# EAGLE design daisy_mp3 (EAGLE 4.16)
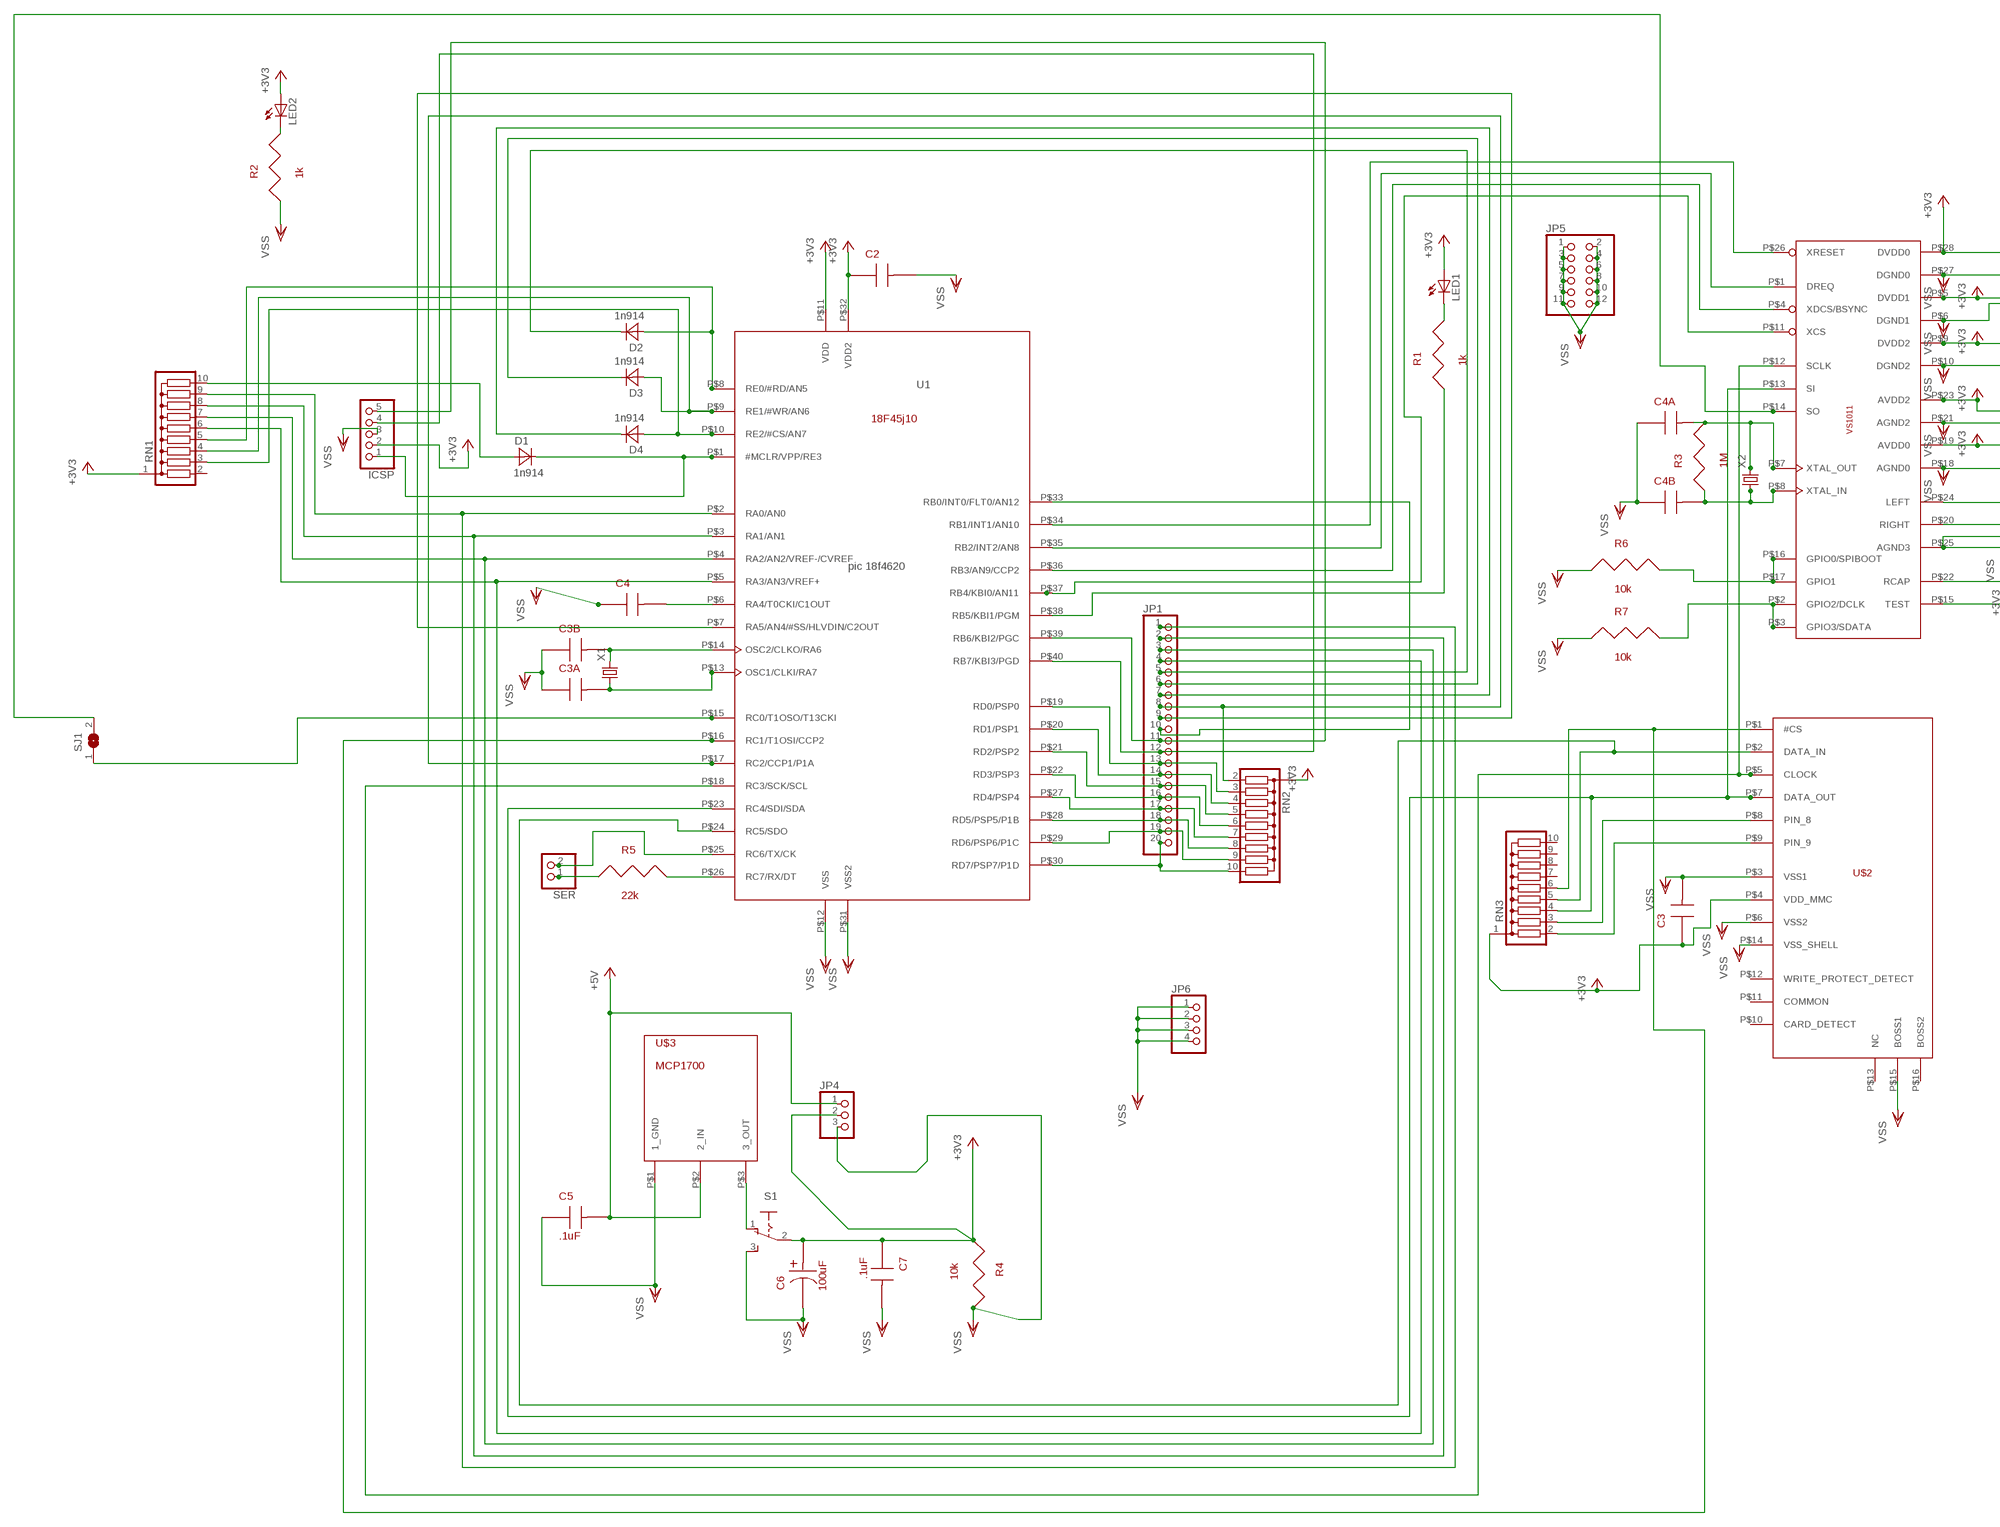
[diagram p0: schematic, sheet 1, part 1 of 2]
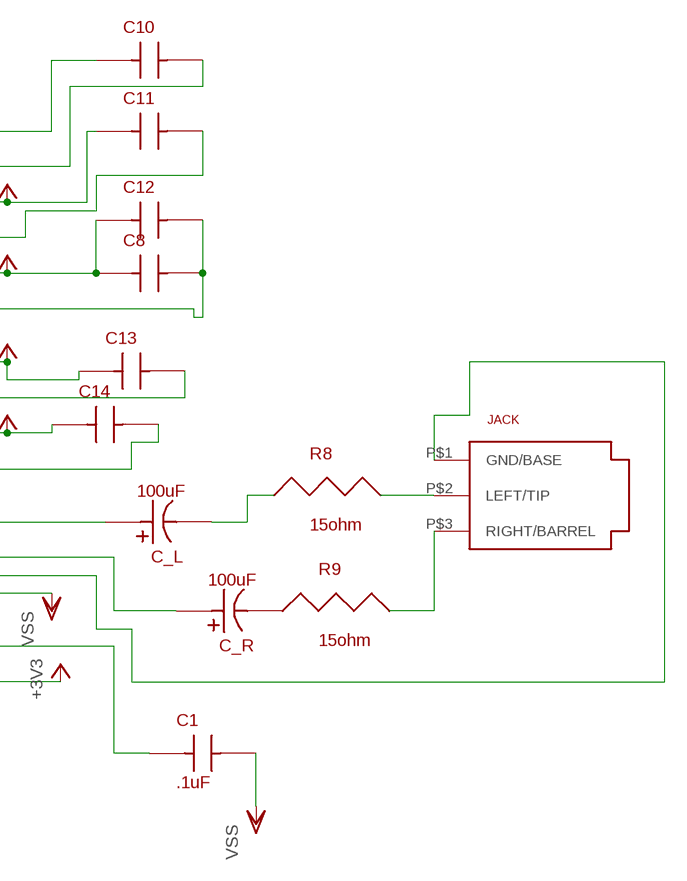
[diagram p1: schematic, sheet 1, part 2 of 2]

## Parts
C1  .1uF  CAPACITOR  [.1"_SPACE]
C2  CAPACITOR  [.1"_SPACE]
C3  CAPACITOR  [.1"_SPACE]
C3A  CAPACITOR  [.1"_SPACE]
C3B  CAPACITOR  [.1"_SPACE]
C4  CAPACITOR  [.1"_SPACE]
C4A  CAPACITOR  [.1"_SPACE]
C4B  CAPACITOR  [.1"_SPACE]
C5  .1uF  CAPACITOR  [.1"_SPACE]
C6  100uF  CAPACITOR_POLARIZED.2"  [.2"]
C7  .1uF  CAPACITOR  [.1"_SPACE]
C8  CAPACITOR  [.1"_SPACE]
C10  CAPACITOR  [.1"_SPACE]
C11  CAPACITOR  [.1"_SPACE]
C12  CAPACITOR  [.1"_SPACE]
C13  CAPACITOR  [.1"_SPACE]
C14  CAPACITOR  [.1"_SPACE]
C_L  100uF  CAPACITOR_POLARIZED.1"  [.1"]
C_R  100uF  CAPACITOR_POLARIZED.1"  [.1"]
D1  1n914  A_SIMPLE_DIODE  [.1"]
D2  1n914  A_SIMPLE_DIODE  [.1"]
D3  1n914  A_SIMPLE_DIODE  [.1"]
D4  1n914  A_SIMPLE_DIODE  [.1"]
ICSP  PINHD-1X5  [1X05]
JACK  STEREO_JACK  [STEREO_JACK]
JP1  PINHD-1X20  [1X20]
JP4  PINHD-1X3  [1X03]
JP5  PINHD-2X6  [2X06]
JP6  PINHD-1X4  [1X04]
LED1  LED5MM  [LED5MM]
LED2  LED5MM  [LED5MM]
R1  1k  RESISTOR.1  [.1"]
R2  1k  RESISTOR.1  [.1"]
R3  1M  RESISTOR.1  [.1"]
R4  10k  RESISTOR.1  [.1"]
R5  22k  RESISTOR.1  [.1"]
R6  10k  RESISTOR.1  [.1"]
R7  10k  RESISTOR.1  [.1"]
R8  15ohm  RESISTOR.1  [.1"]
R9  15ohm  RESISTOR.1  [.1"]
RN1  G09R  [SIL10]
RN2  G09R  [SIL10]
RN3  G09R  [SIL10]
S1  M251RAFFENBERG  [M251]
SER  PINHD-1X2  [1X02]
SJ1  SJ  [SJ]
U1  18F45j10  18F4620  [DIP40]
U$2  MMC_SOCKET_ALPS  [MMC_SD_0MM_STANDOFF_ALPS]
U$3  MCP1700  [TO92]
VS1011  VS1011  [SOIC28]
X1  CRYTALHC49U70  [HC49U70]
X2  CRYTALHC49U70  [HC49U70]

## Nets
+3V3: C2.P$1 C3.P$1 C6.P$2 C7.P$1 C8.P$1 C10.P$1 C11.P$1 C12.P$1 C13.P$1 C14.P$1 ICSP.2 JP4.2 LED1.A LED2.A R4.P$1 RN1.1 RN2.1 RN3.1 S1.2(P) U1.P$11(VDD) U1.P$32(VDD2) U$2.P$4(VDD_MMC) VS1011.P$5(DVDD1) VS1011.P$9(DVDD2) VS1011.P$15(TEST) VS1011.P$19(AVDD0) VS1011.P$23(AVDD2) VS1011.P$28(DVDD0)
+5V: C5.P$2 JP4.1 U$3.P$2(2_IN)
N$1: C_R.P$2 VS1011.P$20(RIGHT)
N$2: JP1.20 RN2.10 U1.P$30(RD7/PSP7/P1D)
N$3: C1.P$1 VS1011.P$22(RCAP)
N$4: R5.P$2 U1.P$26(RC7/RX/DT)
N$5: R6.P$2 VS1011.P$16(GPIO0/SPIBOOT) VS1011.P$17(GPIO1)
N$6: R7.P$2 VS1011.P$2(GPIO2/DCLK) VS1011.P$3(GPIO3/SDATA)
N$7: C4A.P$2 R3.P$2 VS1011.P$7(XTAL_OUT) X2.2
N$8: C4B.P$2 R3.P$1 VS1011.P$8(XTAL_IN) X2.1
N$9: JP1.19 RN2.9 U1.P$29(RD6/PSP6/P1C)
N$10: JP1.18 RN2.8 U1.P$28(RD5/PSP5/P1B)
N$11: JP1.17 RN2.7 U1.P$27(RD4/PSP4)
N$12: JP1.16 RN2.6 U1.P$22(RD3/PSP3)
N$13: JP1.15 RN2.5 U1.P$21(RD2/PSP2)
N$14: JP1.14 RN2.4 U1.P$20(RD1/PSP1)
N$15: JP1.13 RN2.3 U1.P$19(RD0/PSP0)
N$16: JP1.1 RN1.9 U1.P$2(RA0/AN0)
N$17: JP1.2 RN1.8 U1.P$3(RA1/AN1)
N$18: JP1.3 RN1.7 U1.P$4(RA2/AN2/VREF-/CVREF)
N$19: JP1.4 RN1.6 U1.P$5(RA3/AN3/VREF+)
N$20: D2.P$1(A) RN1.5 U1.P$8(RE0/#RD/AN5)
N$21: D3.P$1(A) RN1.4 U1.P$9(RE1/#WR/AN6)
N$22: D4.P$1(A) RN1.3 U1.P$10(RE2/#CS/AN7)
N$23: D2.P$2(C) JP1.5
N$24: D3.P$2(C) JP1.6
N$25: D4.P$2(C) JP1.7
N$26: JP1.8 RN2.2 U1.P$17(RC2/CCP1/P1A)
N$27: S1.1(O) U$3.P$3(3_OUT)
N$28: RN3.2 U$2.P$9(PIN_9)
N$29: C3B.P$2 U1.P$14(OSC2/CLKO/RA6) X1.2
N$30: C3A.P$2 U1.P$13(OSC1/CLKI/RA7) X1.1
N$31: R5.P$1 SER.1
N$32: SER.2 U1.P$25(RC6/TX/CK)
N$33: JP1.9 U1.P$7(RA5/AN4/#SS/HLVDIN/C2OUT)
N$34: JP1.10 U1.P$33(RB0/INT0/FLT0/AN12)
N$35: ICSP.5 JP1.11 U1.P$39(RB6/KBI2/PGC)
N$36: C4.P$2 U1.P$6(RA4/T0CKI/C1OUT)
N$37: SJ1.1 U1.P$15(RC0/T1OSO/T13CKI)
N$38: RN3.3 U$2.P$8(PIN_8)
N$39: RN3.4 U1.P$23(RC4/SDI/SDA) U$2.P$7(DATA_OUT) VS1011.P$13(SI)
N$40: SJ1.2 VS1011.P$14(SO)
N$41: RN3.5 U1.P$24(RC5/SDO) U$2.P$2(DATA_IN)
N$42: RN3.6 U1.P$16(RC1/T1OSI/CCP2) U$2.P$1(#CS)
N$43: U1.P$18(RC3/SCK/SCL) U$2.P$5(CLOCK) VS1011.P$12(SCLK)
N$44: C_L.P$1 R8.P$1
N$45: C_L.P$2 VS1011.P$24(LEFT)
N$46: JACK.P$2(LEFT/TIP) R8.P$2
N$47: JACK.P$3(RIGHT/BARREL) R9.P$2
N$48: LED1.K(C) R1.P$2
N$49: LED2.K(C) R2.P$2
N$50: R1.P$1 U1.P$38(RB5/KBI1/PGM)
N$51: U1.P$34(RB1/INT1/AN10) VS1011.P$26(XRESET)
N$52: U1.P$35(RB2/INT2/AN8) VS1011.P$1(DREQ)
N$53: U1.P$36(RB3/AN9/CCP2) VS1011.P$4(XDCS/BSYNC)
N$54: U1.P$37(RB4/KBI0/AN11) VS1011.P$11(XCS)
N$55: D1.P$2(C) ICSP.1 U1.P$1(#MCLR/VPP/RE3)
N$56: D1.P$1(A) RN1.10
N$57: ICSP.4 JP1.12 U1.P$40(RB7/KBI3/PGD)
N$59: C_R.P$1 R9.P$1
VSS: C1.P$2 C2.P$2 C3.P$2 C3A.P$1 C3B.P$1 C4.P$1 C4A.P$1 C4B.P$1 C5.P$1 C6.P$1 C7.P$2 C8.P$2 C10.P$2 C11.P$2 C12.P$2 C13.P$2 C14.P$2 ICSP.3 JACK.P$1(GND/BASE) JP4.3 JP5.1 JP5.2 JP5.3 JP5.4 JP5.5 JP5.6 JP5.7 JP5.8 JP5.9 JP5.10 JP5.11 JP5.12 JP6.1 JP6.2 JP6.3 JP6.4 R2.P$1 R4.P$2 R6.P$1 R7.P$1 S1.3(S) U1.P$12(VSS) U1.P$31(VSS2) U$2.P$3(VSS1) U$2.P$6(VSS2) U$2.P$14(VSS_SHELL) U$2.P$15(BOSS1) U$3.P$1(1_GND) VS1011.P$6(DGND1) VS1011.P$10(DGND2) VS1011.P$18(AGND0) VS1011.P$21(AGND2) VS1011.P$25(AGND3) VS1011.P$27(DGND0)
Unconnected: RN1.2 RN3.7 RN3.8 RN3.9 RN3.10 U$2.P$10(CARD_DETECT) U$2.P$11(COMMON) U$2.P$12(WRITE_PROTECT_DETECT) U$2.P$13(NC)

## Power pins joined to a net without a drawn wire
BOSS2: U$2.P$16(BOSS2)

## Library data of the parts
C1-C3 C3A C3B C4 C4A C4B C5 C7 C8 C10-C14 = capacitors:CAPACITOR
C6 C_L C_R = capacitors_polarized:CAPACITOR_POLARIZED
D1-D4 = diode:A_SIMPLE_DIODE
ICSP = pinhead:PINHD-1X5: PIN HEADER
JACK = stereo_jack_cuistack__sj3523sm:STEREO_JACK
JP1 = pinhead:PINHD-1X20: PIN HEADER
JP4 = pinhead:PINHD-1X3: PIN HEADER
JP5 = pinhead:PINHD-2X6: PIN HEADER
JP6 = pinhead:PINHD-1X4: PIN HEADER
LED1 LED2 = led:LED: LED OSRAM: - CHIPLED LG R971, LG N971, LY N971, LG Q971, LY Q971, LO R971, LY R971 LH N974, LH R974 LS Q976, LO Q976, LY Q976 LO Q996 - Hyper CHIPLED LW Q18S LB Q993, LB Q99A, LB R99A - SideLED LS A670, LO A670, LY A670, LG A670, LP A670 LB A673, LV A673, LT A673, LW A673 LH A674 LY A675 LS A676, LA A676, LO A676, LY A676, LW A676 LS A679, LY A679, LG A679 - Hyper Micro SIDELED® LS Y876, LA Y876, LO Y876, LY Y876 LT Y87S - SmartLED LW L88C, LW L88S LB L89C, LB L89S, LG L890 LS L89K, LO L89K, LY L89K LS L896, LA L896, LO L896, LY L896 - TOPLED LS T670, LO T670, LY T670, LG T670, LP T670 LSG T670, LSP T670, LSY T670, LOP T670, LYG T670 LG T671, LOG T671, LSG T671 LB T673, LV T673, LT T673, LW T673 LH T674 LS T676, LA T676, LO T676, LY T676, LB T676, LH T676, LSB T676, LW T676 LB T67C, LV T67C, LT T67C, LS T67K, LO T67K, LY T67K, LW E67C LS E67B, LA E67B, LO E67B, LY E67B, LB E67C, LV E67C, LT E67C LW T67C LS T679, LY T679, LG T679 LS T770, LO T770, LY T770, LG T770, LP T770 LB T773, LV T773, LT T773, LW T773 LH T774 LS E675, LA E675, LY E675, LS T675 LS T776, LA T776, LO T776, LY T776, LB T776 LHGB T686 LT T68C, LB T68C - Hyper Mini TOPLED® LB M676 - Mini TOPLED Santana® LG M470 LS M47K, LO M47K, LY M47K Source: http://www.osram.convergy.de/
R1-R9 = resistor:RESISTOR
RN1-RN3 = resistor-sil:G09R: SIL RESISTOR
S1 = switchRaff:M251: SLIDING SWITCH Mors, distributor Buerklin, 11G702
SER = pinhead:PINHD-1X2: PIN HEADER
SJ1 = jumper:SJ: SMD solder JUMPER
U1 = 18F4620:18F4620
U$2 = MMC_SD_alps_socket:MMC_SOCKET_ALPS
U$3 = mcp1700_vregulator:MCP1700
VS1011 = vs1011:VS1011
X1 X2 = crystal:CRYTAL: CRYSTAL

## Board
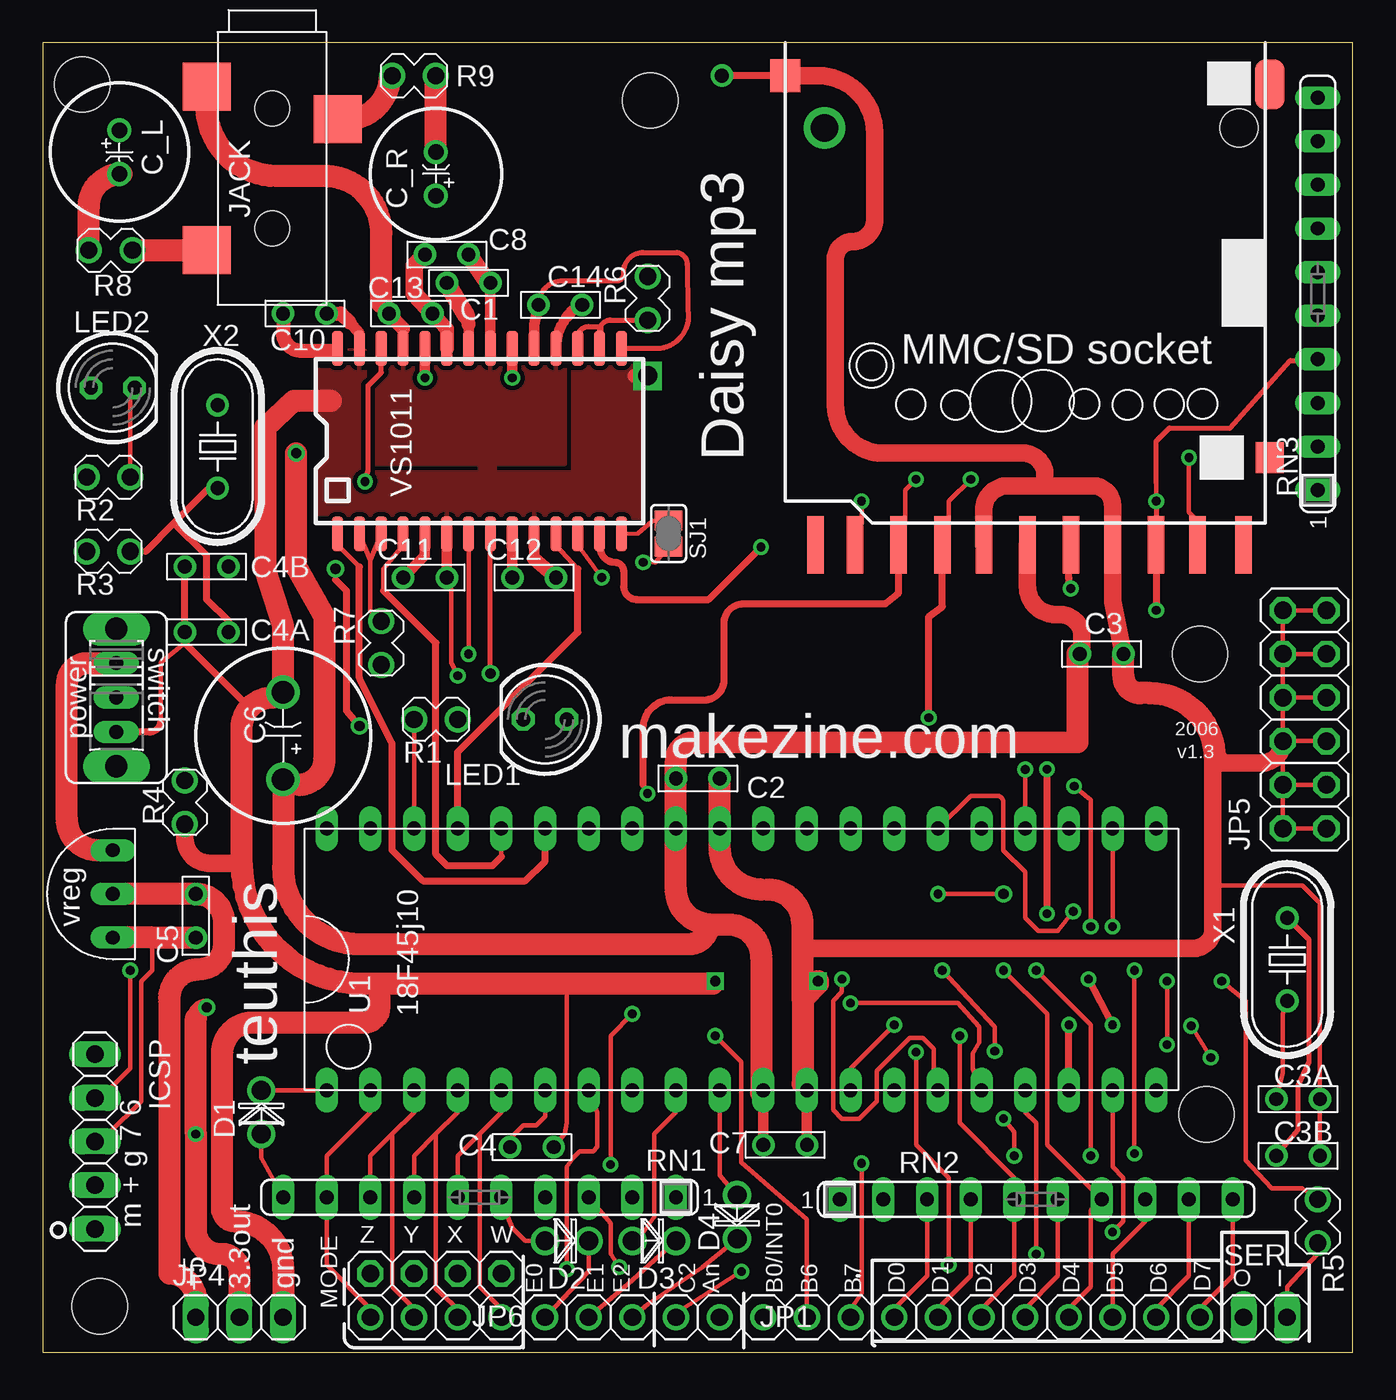
[diagram p2: board, top side]
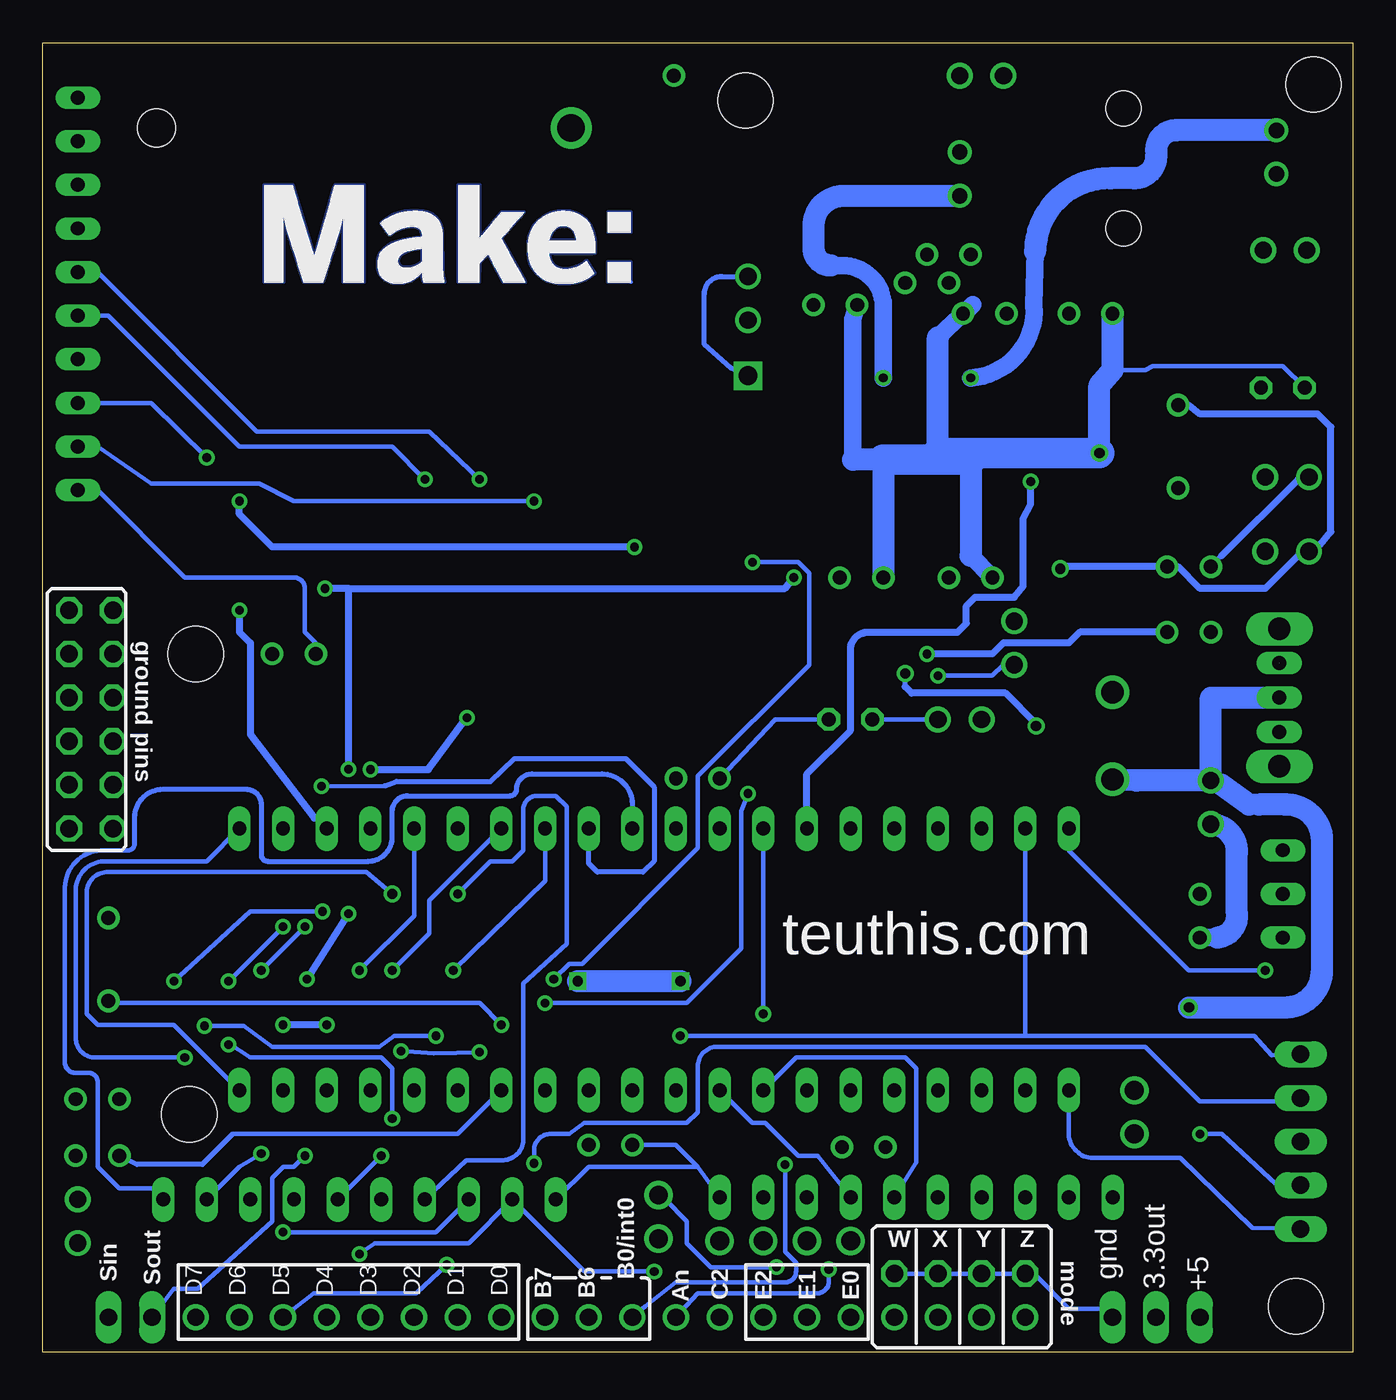
[diagram p3: board, bottom side, seen from below]

Size 76.2 x 76.2 mm. Coordinates in mm from the lower left corner, seen from the top.
Outline: 0,0 76.2,0 76.2,76.2 0,76.2 0,0
Copper layers (1*16): Top 0.035mm / dielectric 1.5mm / Bottom 0.035mm
Design rules "default": minimum track width 10mil, minimum drill 20mil, track to track 8mil, track to pad 8mil, pad to pad 8mil, via to via 8mil, smd to smd 8mil, copper to edge 20mil, drill to drill 8mil, minimum pad ring 10mil, minimum via ring 8mil, stop-mask expansion 4mil, vias tented up to drill 0mil, thermal gap 10mil
Holes 3.2 mm at 35.33,72.85 2.29,73.79 3.3,2.67 67.31,40.64 67.69,13.84
tRestrict: area 67.3,50.8 to 69.8,53.3; area 68.6,59.7 to 71.1,64.8; area 47,55.9 to 49.5,59.1; area 49.5,54 to 51.4,55.9; area 52.1,54 to 54,55.9; area 54.6,53.3 to 59.7,57.8; area 53.3,54 to 55.9,56.5; area 59.7,54 to 61.6,55.9; area 62.2,54 to 64.1,55.9; area 64.8,54 to 68.6,55.9

### Footprints (pad centres in the part's own frame; a part is rotated, then mirrored left to right if it is on the bottom)
.1"_SPACE = drill 0.8 round: P$1 -1.27,0; P$2 1.27,0
.2" = drill 1.3 round: P$1 -2.54,0; P$2 2.54,0
.1" = drill 0.9 round: P$1 -1.27,0; P$2 1.27,0
.1"' = drill 1.1 round: P$1 -1.27,0; P$2 1.27,0
1X05 = drill 1.016 long: 1 -5.08,0; 2 -2.54,0; 3 0,0; 4 2.54,0; 5 5.08,0
STEREO_JACK = smd 2.794 x 2.794: P$1 0,0; P$2 0,-9.525; P$3 7.62,-1.905 | hole 2: 3.81,-1.27; 3.81,-8.255
1X20 = drill 1.016 round: 1 -24.13,0; 2 -21.59,0; 3 -19.05,0; 4 -16.51,0; 5 -13.97,0; 6 -11.43,0; 7 -8.89,0; 8 -6.35,0; 9 -3.81,0; 10 -1.27,0; 11 1.27,0; 12 3.81,0; 13 6.35,0; 14 8.89,0; 15 11.43,0; 16 13.97,0; 17 16.51,0; 18 19.05,0; 19 21.59,0; 20 24.13,0
1X03 = drill 1.016 long: 1 -2.54,0; 2 0,0; 3 2.54,0
2X06 = drill 1.016 octagon: 1 -6.35,-1.27; 2 -6.35,1.27; 3 -3.81,-1.27; 4 -3.81,1.27; 5 -1.27,-1.27; 6 -1.27,1.27; 7 1.27,-1.27; 8 1.27,1.27; 9 3.81,-1.27; 10 3.81,1.27; 11 6.35,-1.27; 12 6.35,1.27
1X04 = drill 1.016 octagon: 1 -3.81,0; 2 -1.27,0; 3 1.27,0; 4 3.81,0
LED5MM = drill 0.813 octagon: A -1.27,0; K 1.27,0
.1"'' = drill 1 round: P$1 -1.27,0; P$2 1.27,0
SIL10 = drill 0.813 long: 1 -11.43,0; 2 -8.89,0; 3 -6.35,0; 4 -3.81,0; 5 -1.27,0; 6 1.27,0; 7 3.81,0; 8 6.35,0; 9 8.89,0; 10 11.43,0
M251 = drill 0.813 long: 1 -2,0; 2 0,0; 3 2,0 | drill 1.3 pad 1.676 long: P$1 -4,0; P$2 4,0
1X02 = drill 1.016 long: 1 -1.27,0; 2 1.27,0
SJ = smd 1.168 x 1.6: 1 -0.762,0; 2 0.762,0
DIP40 = drill 0.8 pad 1.27 long: P$1 -7.62,24.13; P$2 -7.62,21.59; P$3 -7.62,19.05; P$4 -7.62,16.51; P$5 -7.62,13.97; P$6 -7.62,11.43; P$7 -7.62,8.89; P$8 -7.62,6.35; P$9 -7.62,3.81; P$10 -7.62,1.27; P$11 -7.62,-1.27; P$12 -7.62,-3.81; P$13 -7.62,-6.35; P$14 -7.62,-8.89; P$15 -7.62,-11.43; P$16 -7.62,-13.97; P$17 -7.62,-16.51; P$18 -7.62,-19.05; P$19 -7.62,-21.59; P$20 -7.62,-24.13; P$21 7.62,-24.13; P$22 7.62,-21.59; P$23 7.62,-19.05; P$24 7.62,-16.51; P$25 7.62,-13.97; P$26 7.62,-11.43; P$27 7.62,-8.89; P$28 7.62,-6.35; P$29 7.62,-3.81; P$30 7.62,-1.27; P$31 7.62,1.27; P$32 7.62,3.81; P$33 7.62,6.35; P$34 7.62,8.89; P$35 7.62,11.43; P$36 7.62,13.97; P$37 7.62,16.51; P$38 7.62,19.05; P$39 7.62,21.59; P$40 7.62,24.13
MMC_SD_0MM_STANDOFF_ALPS = smd 0.991 x 3.302: P$1 20.066,0; P$2 17.526,0; P$3 15.113,0; P$4 12.573,0; P$5 10.033,0; P$6 7.62,0; P$7 5.08,0; P$8 2.667,0; P$9 22.606,0; P$10 0,0; P$13 24.892,0 | smd 1.702 x 1.803: P$11 -1.524,-5.08 | smd 1.702 x 2.896: P$12 -1.524,-26.797 | smd 1.803 x 1.905: P$14 26.67,-27.305 | drill 0.8 round: P$15 30.353,-27.305 | drill 1.6 pad 1.676 round: P$16 24.384,-24.257 | hole 2.2: 0.254,-24.257
TO92 = drill 0.8 long: P$1 0,0; P$2 2.54,0; P$3 5.08,0
SOIC28 = smd 2.032 x 0.66: P$1 -5.715,8.255; P$2 -5.715,6.985; P$3 -5.715,5.715; P$4 -5.715,4.445; P$5 -5.715,3.175; P$6 -5.715,1.905; P$7 -5.715,0.635; P$8 -5.715,-0.635; P$9 -5.715,-1.905; P$10 -5.715,-3.175; P$11 -5.715,-4.445; P$12 -5.715,-5.715; P$13 -5.715,-6.985; P$14 -5.715,-8.255; P$15 5.08,-8.255; P$16 5.08,-6.985; P$17 5.08,-5.715; P$18 5.08,-4.445; P$19 5.08,-3.175; P$20 5.08,-1.905; P$21 5.08,-0.635; P$22 5.08,0.635; P$23 5.08,1.905; P$24 5.08,3.175; P$25 5.08,4.445; P$26 5.08,5.715; P$27 5.08,6.985; P$28 5.08,8.255
HC49U70 = drill 0.813 round: 1 -2.413,0; 2 2.413,0

### Placement (x,y rotation side)
C1  24.77,62.23 0 top
C2  38.1,33.4 0 top
C3  61.59,40.64 0 top
C3A  73.03,14.73 180 top
C3B  73.03,11.43 180 top
C4  28.45,11.94 180 top
C4A  9.53,41.91 0 top
C4B  9.53,45.72 0 top
C5  8.89,25.4 90 top
C6  13.97,35.88 270 top
C7  43.18,12.06 0 top
C8  23.5,63.88 0 top
C10  15.24,60.45 0 top
C11  22.23,45.09 0 top
C12  28.57,45.09 0 top
C13  21.4,60.45 180 top
C14  30.1,60.96 0 top
C_L  4.45,69.85 90 top
C_R  22.86,68.58 270 top
D1  1n914  [.1"']  12.7,13.97 90 top
D2  1n914  [.1"']  30.48,6.48 0 top
D3  1n914  [.1"']  35.56,6.48 0 top
D4  1n914  [.1"']  40.39,7.87 270 top
ICSP  3.02,12.26 90 top
JACK  9.53,73.66 0 top
JP1  43.18,2.03 0 top
JP4  11.43,2.03 0 top
JP5  73.41,36.83 90 top
JP6  22.86,4.57 180 top
LED1  29.21,36.83 180 top
LED2  4.06,56.13 0 top
R1  1k  [.1"'']  22.86,36.83 0 top
R2  1k  [.1"'']  3.81,50.93 0 top
R3  1M  [.1"'']  3.81,46.61 0 top
R4  10k  [.1"'']  8.26,32 270 top
R5  22k  [.1"'']  74.17,7.62 90 top
R6  10k  [.1"'']  35.18,61.34 270 top
R7  10k  [.1"'']  19.68,41.27 90 top
R8  15ohm  [.1"'']  3.94,64.14 0 top
R9  15ohm  [.1"'']  21.59,74.3 180 top
RN1  25.4,9.02 180 top
RN2  57.78,8.89 0 top
RN3  74.17,61.59 90 top
S1  4.27,38.1 270 top
SER  71.12,2.03 180 top
SJ1  36.4,47.65 90 top
U1  40.64,22.86 90 top
U$2  69.85,46.99 180 top
U$3  4.06,24.13 90 top
VS1011  25.4,53.34 90 top
X1  72.39,22.86 90 top
X2  10.16,52.7 270 top

### Tracks (layer width: path | path; a pad name or v marks a point on that pad's centre or on a via)
+3V3  (via drill 0.51, 0.6)
  Top 0.305: VS1011.P$15 35.95,58.42 arc90 37.52,60.65 37.48,63.27 arc90 36.85,64.01 34.92,64.01 arc90 33.78,62.87 33.78,62.74 arc-90 33.4,62.36 30.23,62.36 arc90 C14.P$1
  Top 0.61: 22.23,47.75 VS1011.P$5 22.23,46.35 C11.P$1 | 27.3,47.75 VS1011.P$9 C12.P$1 | C14.P$1 28.57,59.82 VS1011.P$19 | 41.91,15.11 C7.P$1 | 17.02,58.29 arc90 VS1011.P$28
  Top 0.813: C13.P$1 23.5,59.56 VS1011.P$23 | 17.02,58.29 14.99,58.29 arc-90 13.97,59.31 C10.P$1
  Top 1.016: U1.P$11 41.91,15.11 41.91,14.99 arc-90 41.78,15.11 | 38.73,24.89 38.86,24.89 | C6.P$2 14.86,33.02 | 10.29,5.71 10.41,5.71 | 8.89,19.43 arc-90 v9.53,20.07 | C8.P$1 21.59,63.25 21.59,61.59 C13.P$1 | U$2.P$4 57.28,44.58 arc90 58.93,42.93 59.18,42.93 arc-90 60.45,41.66 60.45,40.89 arc-90 60.2,40.64
  Top 1.27: 41.78,15.11 41.78,22.99 arc90 39.88,24.89 38.86,24.89 arc-90 36.83,26.92 U1.P$32 C2.P$1 36.83,34.42 arc-90 37.85,35.48 38.41,35.48 60.2,35.51 60.2,40.64 C3.P$1 | C6.P$2 13.97,28.19 arc90 18.41,23.75 37.59,23.75 arc90 38.73,24.89 | 14.86,33.02 arc90 16.38,34.54 16.38,42.8 14.73,45.72 v14.73,52.32 | JP4.2 11.43,4.7 arc90 10.41,5.71 | 10.29,5.71 arc-90 8.89,7.11 v8.89,12.7 8.89,19.43
  Bottom 0.254: v8.89,12.7 7.62,12.7 4.45,9.78 ICSP.2 | 38.1,10.79 39.37,12.06 C7.P$1 | 38.1,10.79 RN1.1 | 38.1,10.79 44.45,10.79 RN2.1 | 13.97,57.15 12.06,57.15 11.62,57.4 4.06,57.4 LED2.A | LED1.A 31.11,36.83 33.6,36.82 C2.P$1 | RN3.1 73.03,50.16 67.94,45.09 61.59,45.09 arc90 60.96,44.45 60.96,41.91 60.33,41.27 C3.P$1
  Bottom 1.016: 5.46,31.88 arc-90 6.03,31.88 | R4.P$1 7.68,33.02 arc-90 7.62,33.02 | 24.13,59.05 23.62,59.56 22.1,60.96 C13.P$1 | 29.08,51.94 29.08,60.13 C14.P$1 | 22.23,46.35 C11.P$1
  Bottom 1.27: S1.2 8.26,38.1 R4.P$1 arc-90 8.32,33.27 12.57,33.27 C6.P$2 | v9.53,20.07 3.94,20.07 arc-90 1.78,22.23 1.78,29.84 arc-90 3.94,31.88 5.46,31.88 | 6.03,31.88 7.62,33.02 | C10.P$1 13.97,57.15 14.73,56.26 v14.73,52.32 | 23.62,52.32 23.62,51.94 | 24.13,52.32 24.13,59.05 | 25.4,51.94 25.65,51.94 29.08,51.94 | 27.3,51.94 C12.P$1 | 22.23,51.94 22.23,46.35
  Bottom 1.778: v14.73,52.32 23.62,52.32 24.13,52.32 | 25.65,51.94 27.3,51.94 | 22.23,51.94 23.62,51.94 25.4,51.94
+5V
  Top 1.016: JP4.1 8.89,3.05
  Top 1.27: U$3.P$2 C5.P$2 arc-90 10.54,25.02 10.54,23.75 arc-90 9.08,22.29 arc98 7.37,20.38 7.37,4.57 arc-90 8.89,3.05
MAKE2
  Bottom 0.203: 41.99,62.28 42,62.29
  pour Bottom: 42.01,62.28 43.33,62.28 43.33,63.46 43.32,63.47 42.02,63.47 42.01,63.46
  pour Bottom: 44.1,62.8 44.58,63.54 44.77,63.4 44.98,63.26 45.28,63.14 45.61,63.06 45.99,63.06 46.21,63.11 46.43,63.25 46.55,63.38 46.66,63.57 46.72,63.77 46.75,63.96 44.06,63.97 44.06,64.68 44.16,65.13 44.32,65.58 44.6,65.95 44.83,66.12 45.14,66.31 45.52,66.4 45.9,66.44 46.24,66.42 46.65,66.33 47,66.15 47.34,65.93 47.64,65.58 47.83,65.17 47.93,64.92 46.7,64.91 46.6,65.15 46.45,65.34 46.3,65.46 46.14,65.53 45.71,65.54 45.55,65.48 45.35,65.32 45.28,65.2 45.21,65.04 45.16,64.83 45.17,64.72 46.74,64.71 46.7,64.91 47.93,64.91 47.97,64.57 47.98,64 47.93,63.65 47.84,63.34 47.7,63.07 47.5,62.81 47.18,62.54 46.84,62.35 46.49,62.25 46.22,62.2 45.53,62.19 45.15,62.25 44.72,62.4 44.4,62.57 44.11,62.79
N$1  (via drill 0.51)
  Top 0.61: v27.3,56.71 VS1011.P$20
  Bottom 1.016: 30.35,63.25 29.72,63.25 arc90 27.3,60.9 v27.3,56.71
  Bottom 1.27: C_R.P$2 29.59,67.31 arc-90 31.37,65.53 31.37,64.26 arc-90 30.35,63.25
N$2
  Top 0.254: JP1.20 67.31,2.54 69.22,4.45 RN2.10
  Bottom 0.254: 70.87,29.59 arc90 71.25,29.21 72.64,29.21 arc-90 74.93,27.05 74.93,16.89 arc-90 74.3,16.26 73.53,16.26 arc90 73.03,15.75 73.03,10.79 71.75,9.53 69.85,9.53 RN2.10
  Bottom 0.305: U1.P$30 41.91,31.88 arc-90 43.69,33.66 47.75,33.66 arc-90 48.64,32.77 arc90 49.02,32.38 54.99,32.38 arc-90 55.88,31.5 55.88,29.97 arc90 57.28,28.57 63.12,28.57 arc90 63.5,28.96 63.5,31.88 arc-90 64.39,32.77 69.22,32.77 arc-90 70.87,31.11 70.87,29.59
N$3
  Top 0.61: VS1011.P$22 24.77,59.82
  Top 0.813: 24.77,59.82 24.64,60.33
  Top 1.016: 24.64,60.33 C1.P$1
N$4  (via drill 0.51)
  Top 0.254: v59.94,25.65 59.05,24.51 57.91,24.51 57.15,25.27 57.15,27.94 55.88,29.21 55.88,32 arc90 55.5,32.38 53.98,32.38 U1.P$26 | v68.58,21.59 69.98,20.45 69.98,11.18 71.5,9.53 73.28,9.53 R5.P$2
  Bottom 0.254: v59.94,25.65 64.14,25.65 v68.58,21.59
N$5
  Top 0.305: VS1011.P$17 31.11,59.05 arc-90 31.75,59.69 32.45,59.69 VS1011.P$16 32.38,59.44 arc-90 33.02,60.07 R6.P$2
N$6
  Top 0.254: 19.05,46.1 VS1011.P$3 | 19.05,46.1 VS1011.P$2 | 19.05,46.1 19.05,43.18 R7.P$2
N$7  (via drill 0.51)
  Top 0.254: 9.53,50.16 X2.2 | 5.97,46.61 R3.P$2 | v24.77,40.64 VS1011.P$7 | C4A.P$2 10.79,42.55
  Top 0.406: 7.62,48.26 5.97,46.61 | 7.62,48.26 9.53,50.16 | 7.62,48.26 9.53,46.35 9.53,43.81 10.79,42.55
  Bottom 0.406: v24.77,40.64 20.95,40.64 20.32,41.27 16.51,41.27 15.88,41.91 C4A.P$2
N$8  (via drill 0.6)
  Top 0.305: v17.02,45.59 17.02,44.96 | v26.04,39.5 VS1011.P$8
  Top 0.406: 17.02,44.96 17.65,44.32 17.65,37.34 v18.41,36.45
  Bottom 0.254: 1.91,46.99 R3.P$1 3.17,46.35 | 10.16,45.72 C4B.P$2 | 9.53,55.12 X2.1
  Bottom 0.305: 16.89,45.72 v17.02,45.59 | v18.41,36.45 18.41,36.58 | 26.04,38.73 v26.04,39.5
  Bottom 0.406: 1.91,46.99 1.27,47.75 1.27,53.85 2.03,54.61 8.89,54.61 9.53,55.12 | 10.16,45.72 8.89,44.45 5.08,44.45 3.17,46.35 | C4B.P$2 16.89,45.72 | 18.41,36.58 20.19,38.35 25.65,38.35 26.04,38.73
N$9  (via drill 0.51)
  Top 0.254: v59.99,32.94 60.96,32.13 v60.96,24.77 | v63.5,11.56 v63.5,22.23 | JP1.19 64.77,2.54 66.67,4.45 RN2.9
  Bottom 0.254: v59.99,32.94 56.32,32.96 | v63.5,22.23 v60.96,24.77 | v63.5,11.56 64.77,10.79 RN2.9
  Bottom 0.305: U1.P$29 44.45,28.45 43.94,27.94 41.27,27.94 40.64,28.57 40.64,32.89 42.29,34.54 48.77,34.54 50.16,33.21 55.63,33.22 56.32,32.96
N$10  (via drill 0.51)
  Top 0.254: v52.32,22.23 55.37,18.92 v55.37,17.53 | v50.8,17.46 50.8,12.06 52.7,10.16 v52.7,5.08 | RN2.8 64.14,7.62 62.23,5.71 JP1.18
  Bottom 0.254: v52.32,22.23 46.99,27.43 U1.P$28 | v50.8,17.46 53.47,17.4 v55.37,17.53 | v52.7,5.08 54.48,3.43 60.45,3.43 61.59,2.54 JP1.18
N$11  (via drill 0.51)
  Top 0.254: v55.88,22.23 58.42,19.68 58.42,12.06 RN2.7 60.96,8.26 60.96,3.81 59.69,2.54 JP1.17
  Bottom 0.254: v55.88,22.23 53.72,24.38 53.72,26.29 U1.P$27
N$12  (via drill 0.51)
  Top 0.254: v65.41,17.91 v65.41,21.59 | v55.88,13.59 56.52,12.83 v56.52,11.43 | v62.23,24.77 U1.P$22 | JP1.16 57.15,2.54 59.05,4.45 RN2.6
  Bottom 0.254: v65.41,21.59 v62.23,24.77 | v65.41,17.91 65.41,17.97 64.14,17.14 56.52,17.14 55.88,16.51 v55.88,13.59 | RN2.6 v56.52,11.43
N$13  (via drill 0.51)
  Top 0.254: v66.8,18.99 v67.94,17.14 | v53.34,18.41 53.34,13.34 56.52,10.16 RN2.5 56.52,4.45 54.61,2.54 JP1.15
  Bottom 0.254: v67.94,17.14 73.15,17.14 arc90 74.3,18.29 74.3,26.92 arc90 72.52,28.57 66.67,28.57 U1.P$21 | v66.8,18.99 64.52,18.99 62.87,17.78 56.64,17.78 55.75,18.41 v53.34,18.41
N$14  (via drill 0.51, 0.6)
  Top 0.254: v52.07,26.67 v55.88,26.67 | JP1.14 52.07,2.54 53.98,4.45 RN2.4
  Bottom 0.254: v55.88,26.67 57.4,27.94 72.39,27.94 arc-90 73.66,26.8 73.66,19.68 73.03,19.05 68.58,19.05 U1.P$20 | v52.07,26.67 50.16,28.57 48.9,28.57 48.26,29.21 48.26,31.62 arc90 47.37,32.38 46.35,32.38 45.72,31.75 45.72,23.75 48.26,21.46 48.26,12.45 arc90 49.4,11.18 51.56,11.18 RN2.4
N$15  (via drill 0.51)
  Top 0.254: v62.23,6.99 62.87,7.62 62.87,10.16 62.23,10.79 U1.P$19 | JP1.13 49.53,2.54 51.44,4.45 RN2.3
  Bottom 0.254: v62.23,6.99 53.34,6.99 RN2.3
N$16
  Top 0.254: U1.P$2 19.05,13.97 16.51,11.43 RN1.9 16.51,5.08 19.05,2.54 JP1.1
N$17
  Top 0.254: 20.32,12.7 19.05,11.43 RN1.8 | 20.32,12.7 21.59,13.97 U1.P$3 | 20.32,12.7 20.32,3.81 21.59,2.54 JP1.2
N$18
  Top 0.254: 22.86,12.7 21.59,11.43 RN1.7 | 22.86,12.7 24.13,13.97 U1.P$4 | 22.86,12.7 22.86,3.68 24.13,2.54 JP1.3
N$19
  Top 0.254: 25.4,12.7 24.13,11.43 RN1.6 | 25.4,12.7 26.67,13.97 U1.P$5 | 25.4,12.7 25.4,3.81 26.67,2.54 JP1.4
N$20
  Top 0.254: D2.P$1 28.07,6.48 27.3,7.24 27.05,7.87 RN1.5
  Bottom 0.254: U1.P$8 32.38,17.14 26.04,17.14 25.4,16.51 25.4,11.05 RN1.5
N$21
  Top 0.254: U1.P$9 36.83,13.97 35.56,12.7 35.56,7.87 34.92,6.99 D3.P$1
  Bottom 0.254: RN1.4 31.11,11.43 32.26,11.43 34.16,13.34 34.92,13.34 U1.P$9
N$22  (via drill 0.51)
  Top 0.254: U1.P$10 39.37,10.29 40.01,9.53 D4.P$1 | v33.53,4.95 33.02,5.71 33.02,7.49 RN1.3
  Bottom 0.254: v33.53,4.95 37.34,4.95 38.73,6.35 38.73,7.62 40.01,8.89 D4.P$1
N$23
  Top 0.254: JP1.5 31.75,4.7 D2.P$2
N$24
  Top 0.254: D3.P$2 34.04,3.94 JP1.6
N$25
  Top 0.254: JP1.7 35.18,2.79 38.35,4.95 D4.P$2
N$26  (via drill 0.51)
  Top 0.254: v57.78,5.71 57.78,13.34 57.15,13.97 U1.P$17 | v40.64,4.7 37.21,2.54 JP1.8
  Bottom 0.254: v57.78,5.71 56.9,6.35 51.44,6.35 RN2.2 44.7,4.7 v40.64,4.7
N$27  (1 unrouted)
  Top 1.016: U$3.P$3 3.17,29.21
  Top 1.27: 3.17,29.21 arc-90 1.4,30.99 1.4,38.89 arc-90 2.62,40.11 S1.1
N$28  (via drill 0.51)
  Top 0.254: v47.62,49.53 47.62,48.26 U$2.P$9
  Bottom 0.254: v47.62,49.53 61.59,49.53 63.63,50.55 69.91,50.55 73.03,52.7 RN3.2
N$29
  Top 0.305: X1.2 73.66,24 73.66,16.89 73.03,15.49 73.03,12.95 C3B.P$2
  Bottom 0.254: 65.15,12.7 52.07,12.7 U1.P$14
  Bottom 0.305: 65.15,12.7 66.93,10.92 70.74,10.92 C3B.P$2
N$30  (via drill 0.51)
  Top 0.254: v49.53,19.05 46.99,16.51 U1.P$13 | C3A.P$2 72.14,16.26 72.14,19.68 X1.1
  Bottom 0.254: v49.53,19.05 50.8,20.32 71.75,20.32 X1.1
N$31
  Top 0.254: R5.P$1 74.17,5.71 72.39,3.81 SER.1
N$32  (via drill 0.51)
  Top 0.254: v57.78,22.23 60.96,19.05 v60.96,11.43
  Bottom 0.254: v57.78,22.23 54.61,25.4 U1.P$25 | v60.96,11.43 61.59,10.79 62.23,10.79 62.87,10.16 62.87,7.62 67.18,3.68 68.58,3.68 SER.2
N$33  (via drill 0.51)
  Top 0.254: v30.48,4.83 30.48,10.79 30.86,11.3 31.24,11.68 32,11.68 32.26,11.94 32.26,13.97 U1.P$7
  Bottom 0.254: v30.48,4.83 30.48,4.06 arc90 31.24,3.43 38.1,3.43 JP1.9
N$34  (via drill 0.51)
  Top 0.254: v34.29,19.68 33.02,18.41 v33.02,10.92
  Bottom 0.254: v33.02,10.92 33.02,5.84 32.38,5.21 32.38,4.7 arc90 33.02,4.06 39.37,4.06 41.15,2.67 JP1.10 | v34.29,19.68 U1.P$33
N$35  (via drill 0.51)
  Top 0.254: v39.12,18.41 40.64,16.89 40.64,11.05 44.45,7.75 JP1.11
  Bottom 0.254: 19.05,18.41 5.71,18.41 4.7,17.27 ICSP.5 | 19.05,18.41 U1.P$39 | 19.05,18.41 v39.12,18.41
N$36
  Top 0.254: C4.P$2 27.18,12.45 27.94,13.21 28.7,13.21 29.21,13.72 U1.P$6
N$37  (via drill 0.51)
  Top 0.254: v34.92,45.97 35.61,45.95 SJ1.1 | v46.48,21.72 46.48,20.95 45.97,20.45 45.97,14.1 46.48,13.59 47.5,13.59 48.51,14.61 48.51,16.38 50.42,18.29 51.18,18.29 51.82,17.65 51.82,16.51 U1.P$15
  Bottom 0.254: v34.92,45.97 32.26,45.97 31.62,45.34 31.62,40.01 38.1,33.53 38.1,29.34 44.83,22.61 45.59,22.61 v46.48,21.72
N$38  (via drill 0.51)
  Top 0.254: v66.67,52.07 66.67,48.9 67.31,48.26 U$2.P$8
  Bottom 0.254: v66.67,52.07 69.91,55.24 RN3.3
N$39  (via drill 0.51)
  Top 0.254: U$2.P$7 64.77,50.61 | VS1011.P$13 32.38,46.99
  Top 0.305: v64.77,49.53 U$2.P$7 | 64.77,50.61 64.77,53.02 65.53,53.78 69.09,53.78 72.58,57.72 74.23,57.72 RN3.4
  Top 0.406: 32.38,46.99 32.38,46.93 arc90 33.27,45.97 arc-90 33.78,45.47 33.78,44.58 arc90 34.54,43.81 38.73,43.81 v41.78,46.86 | U$2.P$7 v64.77,43.18
  Bottom 0.254: 60.42,31.09 U1.P$23
  Bottom 0.406: v64.77,43.18 64.77,41.91 64.14,41.27 64.14,35.94 60.42,31.09 | v41.78,46.86 62.87,46.86 64.77,48.77 v64.77,49.53
N$40
  Top 0.254: VS1011.P$14 34.59,47.65 35.46,48.39 SJ1.2
N$41  (via drill 0.51)
  Top 0.254: U1.P$24 v57.15,33.91 | v53.98,50.8 52.7,49.53 52.7,48.26 U$2.P$2
  Top 0.406: v51.54,36.93 51.54,42.82 52.32,43.41 U$2.P$2
  Bottom 0.254: v53.98,50.8 55.88,52.7 64.77,52.7 72.39,60.33 RN3.5
  Bottom 0.406: v57.15,33.91 53.77,33.91 v51.54,36.93
N$42  (via drill 0.51)
  Top 0.254: v46.99,20.32 53.21,20.32 54.48,18.92 54.48,18.03 54.1,17.4 54.1,16.51 U1.P$16 | v35.18,32.51 34.92,33.02 | v50.8,50.8 50.16,50.16 50.16,48.26 U$2.P$1
  Top 0.406: 34.92,33.02 34.92,36.32 arc-90 36.58,37.97 38.61,37.97 arc90 39.62,39.24 39.62,42.42 arc-90 40.77,43.56 49.02,43.56 49.78,44.2 U$2.P$1
  Bottom 0.254: v46.99,20.32 38.73,20.32 35.56,23.5 35.56,31.5 v35.18,32.51 | v50.8,50.8 53.72,53.59 63.75,53.59 73.03,62.87 RN3.6
N$43  (via drill 0.51)
  Top 0.254: v32.51,45.09 31.11,46.99 VS1011.P$12 | 59.69,45.72 U$2.P$5
  Top 0.406: v59.79,44.45 59.69,45.09 59.69,45.72 | v62.23,19.05 v60.83,21.72 | v58.42,25.53 v58.42,33.93 | U1.P$18 v59.69,19.05
  Bottom 0.406: v32.51,45.09 33.02,44.45 58.42,44.45 | 58.42,44.45 v59.79,44.45 | v59.69,19.05 v62.23,19.05 | v60.83,21.72 v58.42,25.53 | v58.42,33.93 58.42,44.45
N$44
  Top 1.016: 4.57,68.58 C_L.P$1
  Top 1.27: R8.P$1 2.67,66.67 arc-90 4.57,68.58
N$45  (via drill 0.51)
  Top 0.61: v22.23,56.71 VS1011.P$24
  Bottom 1.016: 18.48,64.07 18.54,60.9 arc90 v22.23,56.71
  Bottom 1.27: C_L.P$2 10.29,71.12 arc-90 11.43,69.98 11.43,69.6 arc90 12.7,68.33 14.1,68.33 arc-90 18.48,64.07
N$46
  Top 1.27: R8.P$2 JACK.P$2
N$47
  Top 1.016: 20.19,74.3 R9.P$2 | JACK.P$3 17.65,71.75
  Top 1.27: 17.65,71.75 arc90 20.19,74.3
N$48
  Bottom 0.254: R1.P$2 LED1.K
N$49
  Top 0.254: LED2.K 5.08,55.88 R2.P$2
N$50
  Top 0.254: U1.P$38 R1.P$1
N$51  (via drill 0.51)
  Top 0.305: VS1011.P$26 19.68,57.02 18.92,56.26 18.92,51.31 v18.73,50.67
  Bottom 0.406: v18.73,50.67 18.73,49.34 19.18,48.51 19.18,44.58 19.68,43.94 21.97,43.94 22.48,43.43 22.48,42.42 22.99,41.91 28.19,41.91 arc-90 29.21,40.89 29.21,36.2 31.75,33.66 U1.P$34
N$52
  Top 0.254: 18.41,45.72 17.14,46.99 VS1011.P$1
  Top 0.406: 18.41,45.72 18.41,39.24 20.32,35.43 20.32,29.21 22.1,27.43 28.07,27.43 29.21,28.57 U1.P$35
N$53
  Top 0.254: 19.81,44.32 19.81,45.59 20.95,46.99 VS1011.P$4 | 26.67,28.83 U1.P$36
  Top 0.406: 19.81,44.32 22.86,41.27 22.86,28.96 23.5,28.32 26.16,28.32 26.67,28.83
N$54
  Top 0.254: 31.11,45.59 29.84,46.99 VS1011.P$11
  Top 0.406: 31.11,45.59 31.11,41.91 24.13,34.92 U1.P$37
N$55
  Top 0.254: U1.P$1 D1.P$2
  Bottom 0.254: ICSP.1 5.84,7.24 10.03,11.3 15.24,11.3 arc90 16.51,12.95 U1.P$1
N$56
  Top 0.254: RN1.10 12.7,11.3 D1.P$1
N$57  (via drill 0.51)
  Top 0.254: v5.08,22.23 5.08,16.51 3.81,15.24 ICSP.4 | v47.62,10.99 47.62,3.43 46.99,2.54 JP1.12
  Bottom 0.254: v5.08,22.23 9.53,22.23 16.51,29.21 U1.P$40 | v47.62,10.99 47.62,11.68 arc90 46.74,12.7 45.59,12.7 44.7,13.34 38.73,13.34 38.1,13.97 38.1,16.64 arc90 36.96,17.78 12.06,17.78 8.89,14.61 4.45,14.61 ICSP.4
N$59
  Top 1.016: 22.73,69.72 arc90 C_R.P$1 arc-90 22.73,69.72
  Top 1.27: C_R.P$1 R9.P$1
N$61
  pour Bottom: 41.99,65.18 43.31,65.18 43.32,65.17 43.32,66.37 42,66.37 42,65.19
N$64
  pour Bottom: 48.11,62.27 49.41,62.27 50.3,63.93 50.8,63.4 50.8,62.27 52.05,62.27 52.05,67.95 50.8,67.95 50.8,64.85 50.78,64.85 49.54,66.36 48.19,66.36 48.2,66.35 49.52,64.83 48.11,62.28
N$65
  pour Bottom: 52.82,62.27 54.06,62.27 54.11,62.42 54.12,62.56 54.14,62.86 54.25,63.18 54.13,63.5 54.13,64.25 54.32,64.57 54.14,64.93 54.15,65.13 54.22,65.32 54.35,65.43 54.56,65.51 54.89,65.51 55.17,65.45 55.44,65.36 55.69,65.24 55.91,65.1 56.04,65.02 56.56,65.7 56.32,65.92 56.05,66.1 55.79,66.22 55.5,66.33 55.17,66.4 54.84,66.44 54.61,66.44 54.38,66.43 54.06,66.41 53.78,66.34 53.52,66.23 53.31,66.06 53.18,65.9 53.05,65.66 52.99,65.43 52.96,65.22 52.94,62.94 52.91,62.61 52.85,62.41
N$66
  pour Bottom: 54.1,62.9 54.41,62.6 54.61,62.45 54.84,62.33 55.06,62.27 55.21,62.23 55.85,62.23 56.09,62.3 56.32,62.43 56.49,62.58 56.62,62.77 56.72,63.03 56.73,63.12 56.72,63.57 56.65,63.82 56.54,64.04 56.35,64.27 56.13,64.42 55.85,64.57 55.54,64.66 55.23,64.75 54.88,64.81 54.5,64.86 54.12,64.91 54.13,64.24 54.52,64.21 54.82,64.14 55.1,64.04 55.33,63.92 55.45,63.77 55.53,63.59 55.53,63.44 55.46,63.29 55.29,63.18 55.14,63.14 54.95,63.14 54.74,63.17 54.53,63.25 54.31,63.36 54.08,63.56 53.98,62.89
N$67
  pour Bottom: 57.52,62.27 58.74,62.27 58.74,66.19 58.89,65.43 59.92,62.27 61.02,62.27 62.08,65.57 62.2,66.22 62.2,62.27 63.34,62.27 63.33,67.95 61.66,67.95 60.45,63.89 60.41,63.78 60.38,63.83 59.28,67.77 59.21,67.95 57.52,67.95
VSS  (via drill 0.51, 0.6, 1.1)
  Top 0.254: 6.86,36.75 6.86,40.13 8.26,41.27 C4A.P$1 | JP5.11 JP5.12 JP5.10 | JP5.8 JP5.7 | JP5.10 JP5.9 | JP5.8 JP5.10 | JP5.1 JP5.2 JP5.4 | JP5.4 JP5.3 | C3B.P$1 C3A.P$1 74.3,26.16 73.28,27.18 68.01,27.18 68.01,24.13 67.17,23.52 | C4.P$1 30.35,12.7 30.48,13.34 30.48,21.46 30.48,21.59 | v24.13,39.37 23.75,40.13 23.75,44.39 C11.P$2 | 6.35,24.13 6.35,22.23 5.71,21.59 5.71,14.61 3.81,12.7 ICSP.3 | JP5.6 JP5.5 | JP5.6 72.14,35.43 JP5.4 | JP5.6 JP5.8 | 68.19,34.58 67.94,34.29 68.07,34.29
  Top 0.406: C4A.P$1 C4B.P$1 | 8.26,41.27 11.43,38.1 12.04,37.53 | U$2.P$14 U$2.P$15 | 6.86,36.75 arc-90 6.2,36.09 4.5,36.09 | 4.5,36.09 4.5,36.12 4.52,36.12 arc-90 4.5,36.09 | S1.3 4.14,36.09 | S1.3 arc90 S1.3 | 4.5,36.09 S1.3
  Top 0.61: VS1011.P$18 arc-58 31.24,60.96 | VS1011.P$21 C1.P$2 | 20.95,59.56 VS1011.P$25 | VS1011.P$27 18.41,59.31 17.84,59.94 | 28.57,46.16 VS1011.P$10 | C11.P$2 VS1011.P$6 | U1.P$12 C7.P$2
  Top 0.813: 31.24,60.96 C14.P$2 | C13.P$2 20.95,59.56 | 17.84,59.94 17.34,60.45 C10.P$2 | C12.P$2 28.57,46.16 | v35.18,56.83 34.42,56.83
  Top 1.016: 42.16,26.92 41.78,26.92 | U1.P$12 44.45,15.37 arc-90 44.2,15.62 | 13.34,38.1 C6.P$1 | 38.99,21.46 arc90 v39.12,21.59 | 44.2,23.5 66.93,23.5 arc12 67.17,23.52 arc78 68.07,24.64 68.07,34.29 70.74,34.29 arc90 72.14,35.43 arc90 JP5.6 | C3.P$2 arc90 62.74,40.77 arc-90 C3.P$2 | C3.P$2 62.23,43.69 U$2.P$6 62.23,49.28 arc90 61.09,50.42 58.29,50.42 | 58.29,50.42 56.13,50.42 arc90 54.74,49.02 U$2.P$3 | U$2.P$14 45.09,74.3 arc-90 48.39,70.99 48.39,65.91 arc-90 47.12,64.64 arc90 46.1,63.63 46.1,55.12 arc90 48.9,52.32 57.02,52.32 arc-90 58.29,51.05 58.29,50.42 | R4.P$2 8.26,29.84 arc90 9.78,28.45 11.56,28.45 | 9.53,72.52 JACK.P$1 | C13.P$2 19.81,60.96 arc-90 19.68,61.09 | C1.P$2 25.91,62.23 C8.P$2
  Top 1.27: 41.78,26.92 arc-90 39.37,29.4 U1.P$31 C2.P$2 | 42.16,26.92 arc-90 44.2,24.89 44.2,23.5 44.2,20.57 | 44.2,20.57 44.2,15.62 | 13.34,38.1 arc47 12.04,37.53 arc43 11.56,36.32 11.56,28.45 arc90 18.54,21.46 19.56,21.46 | 19.56,21.46 30.48,21.46 38.99,21.46 | C6.P$1 13.97,42.29 12.95,45.47 12.95,53.85 14.61,55.37 16.76,55.37 | C5.P$1 6.35,24.13 U$3.P$1 | JP4.3 13.97,4.83 arc90 11.18,7.62 arc-90 10.41,8.38 10.41,17.4 arc-90 12.19,19.18 18.67,19.18 arc90 19.56,20.07 19.56,21.46 | 9.53,72.52 arc90 13.59,68.45 16.38,68.45 arc-90 19.68,65.15 19.68,61.09 | v45.09,21.59 45.09,21.46 44.2,20.57 | C3.P$2 62.87,39.34 arc90 63.85,38.35 64.42,38.35 arc-90 68.19,34.58 68.28,34.58
  Bottom 0.254: 7.62,46.35 8.26,45.85 C4B.P$1 | 3.17,50.8 R2.P$1 | JP6.1 JP6.2 JP6.3 JP6.4 18.41,4.45 16.51,2.54 14.61,2.54 JP4.3 | v24.13,39.37 20.95,39.37 20.32,40.01 R7.P$1
  Bottom 0.305: R6.P$1 36.7,62.61 arc-90 37.72,61.59 37.72,58.65 36.2,57.28 v35.18,56.83
  Bottom 0.406: 7.62,46.35 3.17,50.8
  Bottom 1.016: C5.P$1 7.87,24.13
  Bottom 1.27: 7.87,24.13 arc-90 6.73,25.53 6.73,29.08 arc-90 R4.P$2 | v39.12,21.59 v45.09,21.59
  pour Top (isolate 0.254): 15.88,48.77 15.88,51.44 16.51,52.07 16.51,53.98 15.88,54.61 15.88,57.15 17.21,57.15 17.21,58.29 18.73,58.29 18.73,56.52 18.8,51.18 25.4,51.18 25.4,51.69 19.3,51.69 19.3,57.78 30.35,57.78 30.35,51.69 26.29,51.69 26.29,51.18 30.86,51.18 30.86,57.4 34.92,57.4 34.92,48.58 33.85,48.58 33.85,48.26 16.95,48.26 16.95,48.77

### Text on the board
tPlace: Daisy mp3 | switch | 2006 | makezine.com | v1.3 | m + g 7 6 | +5 | 3.3out | gnd
bPlace: gnd | +5 | 3.3out
tNames: MMC/SD socket | power | vreg | teuthis | Z | Y | X | W | D7 | O | I | MODE | E0 | E1 | E2 | C2 | An | B0/INT0 | B6 | B7 | D0 | D1 | D2 | D3 | D4 | D5 | D6
bNames: ground pins | teuthis.com | B0/int0 | Sout | Z | Y | X | W | Sin | mode | An | B6 | B7 | D0 | D1 | D2 | D3 | D4 | D5 | D6 | D7 | E0 | E1 | E2 | C2
bValues: Daisy mp3 | makezine.com